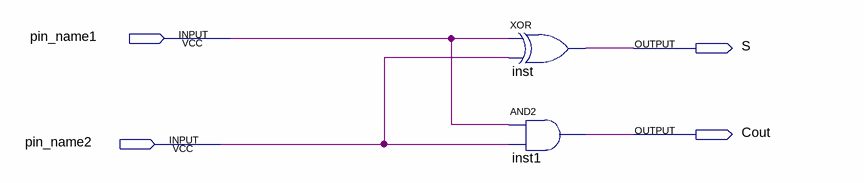
[diagram p0: schematic sheet]
// Quartus schematic half-adder.bdf as structural Verilog: 2 symbols, 4 pins
module \half-adder  (
  input  pin_name1,
  input  pin_name2,
  output S,
  output Cout
);

  xor inst (S, pin_name1, pin_name2);
  and inst1 (Cout, pin_name1, pin_name2);
endmodule
